# EAGLE design M720 (EAGLE 6.6.0)
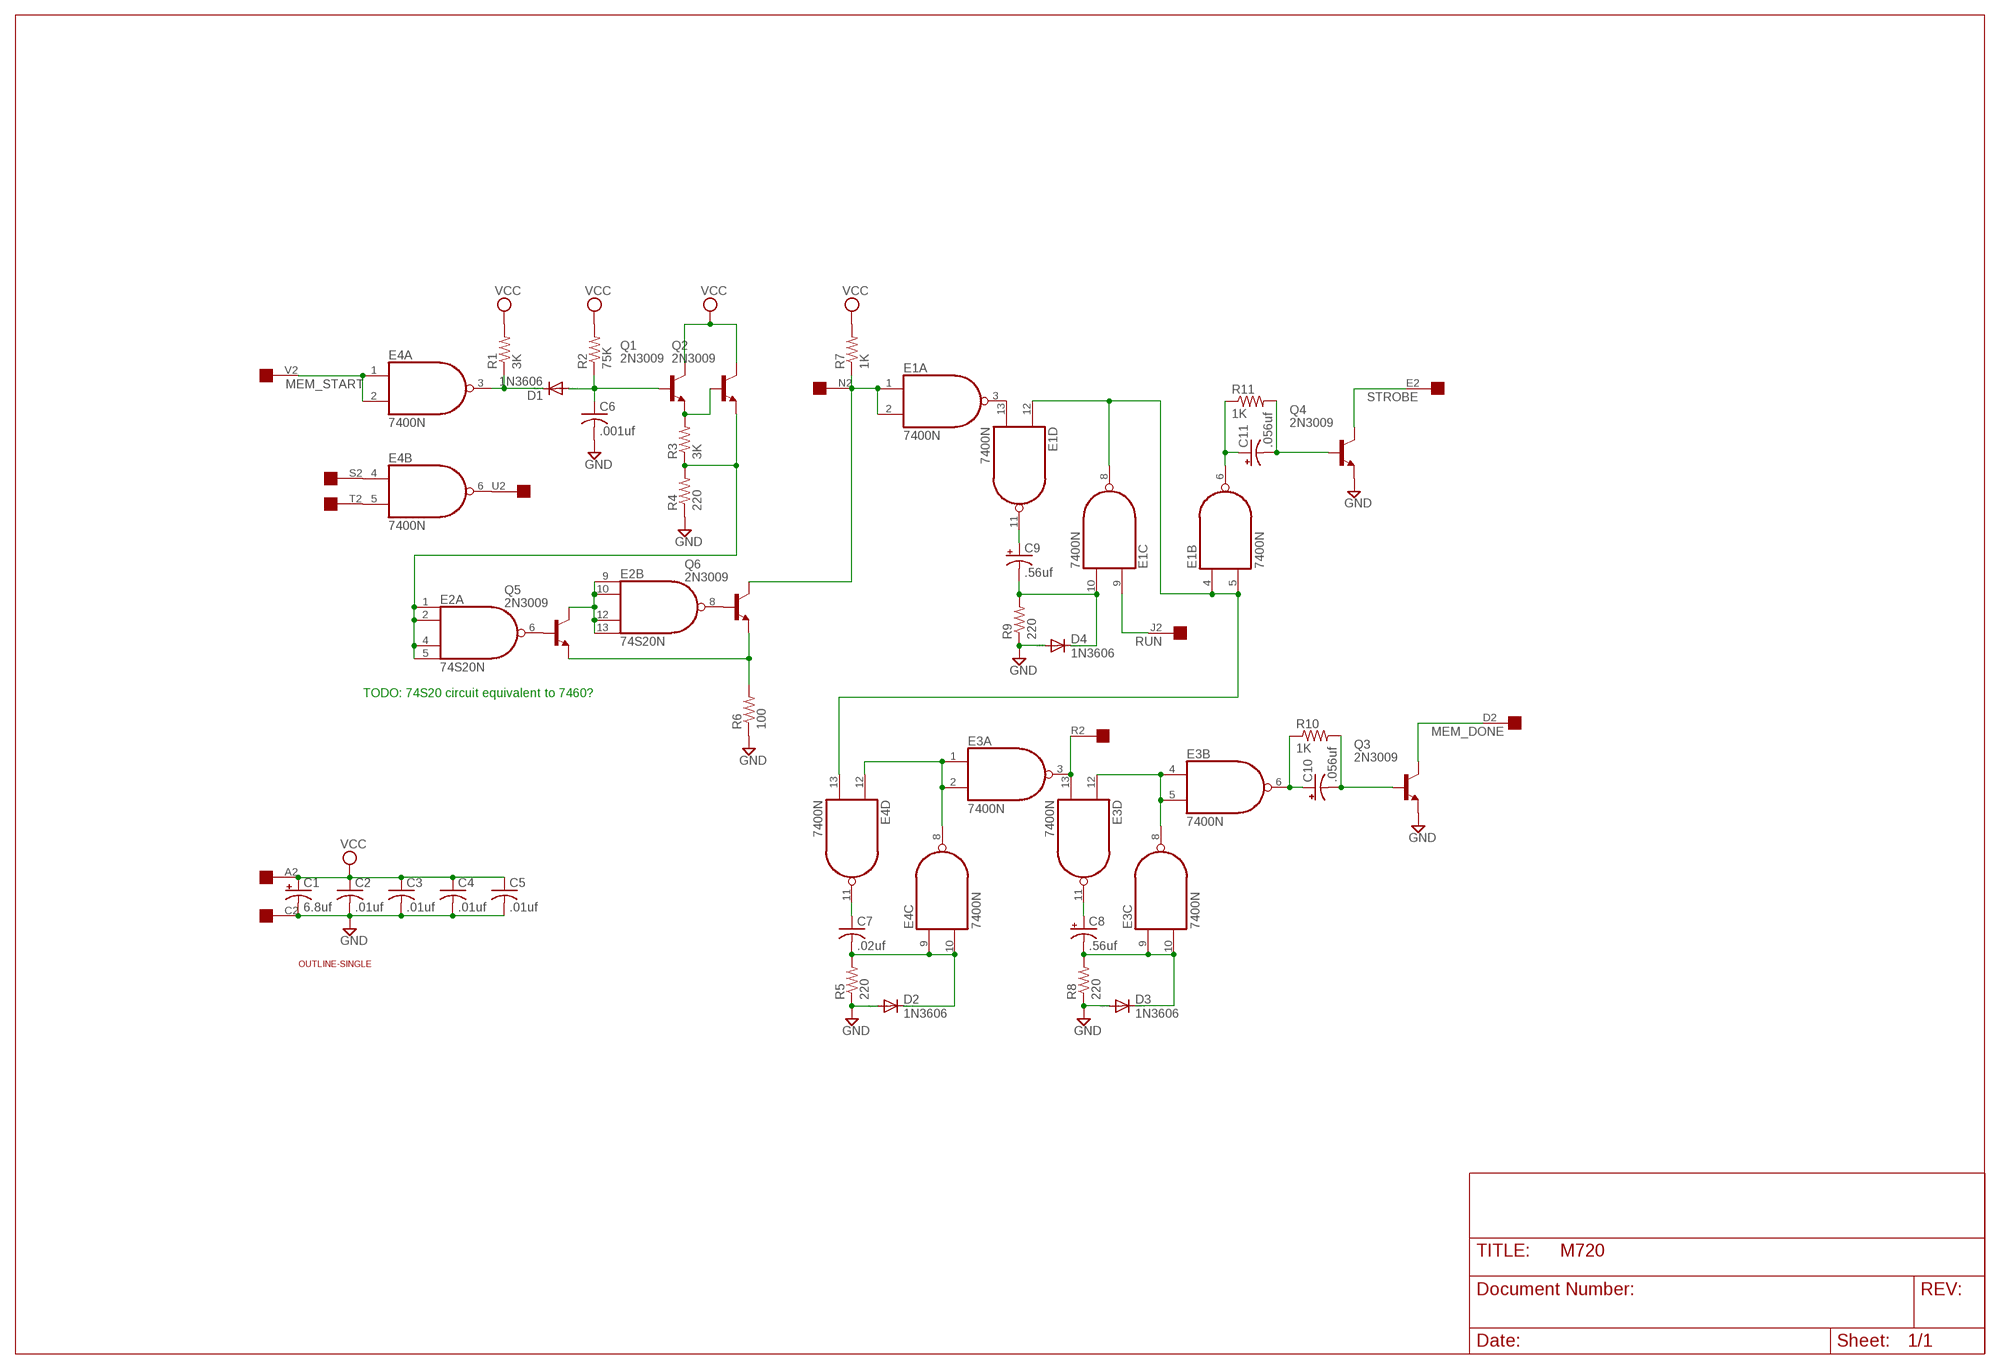
[diagram p0: schematic, sheet 1]

## Parts
C1  6.8uf  CPOL-USE15-5AXIAL  [E15-5]
C2  .01uf  C-US050-025X075  [C050-025X075]
C3  .01uf  C-US050-025X075  [C050-025X075]
C4  .01uf  C-US050-025X075  [C050-025X075]
C5  .01uf  C-US050-025X075  [C050-025X075]
C6  .001uf  C-US050-025X075  [C050-025X075]
C7  .02uf  C-US050-025X075  [C050-025X075]
C8  .56uf  CPOL-USB45181C  [B45181C]
C9  .56uf  CPOL-USB45181C  [B45181C]
C10  .056uf  CPOL-USB45181C  [B45181C]
C11  .056uf  CPOL-USB45181C  [B45181C]
D1  1N3606  1N4148DO35-10  [DO35-10]
D2  1N3606  1N4148DO35-10  [DO35-10]
D3  1N3606  1N4148DO35-10  [DO35-10]
D4  1N3606  1N4148DO35-10  [DO35-10]
E1  7400N  [DIL14]
E2  74S20N  [DIL14]
E3  7400N  [DIL14]
E4  7400N  [DIL14]
Q1  2N3009  2N2405  [TO5]
Q2  2N3009  2N2405  [TO5]
Q3  2N3009  2N2405  [TO5]
Q4  2N3009  2N2405  [TO5]
Q5  2N3009  2N2405  [TO5]
Q6  2N3009  2N2405  [TO5]
R1  3K  R-US_0207/10  [0207/10]
R2  75K  R-US_0207/10  [0207/10]
R3  3K  R-US_0207/10  [0207/10]
R4  220  R-US_0207/10  [0207/10]
R5  220  R-US_0207/10  [0207/10]
R6  100  R-US_0207/10  [0207/10]
R7  1K  R-US_0207/10  [0207/10]
R8  220  R-US_0207/10  [0207/10]
R9  220  R-US_0207/10  [0207/10]
R10  1K  R-US_0207/10  [0207/10]
R11  1K  R-US_0207/10  [0207/10]
U$1  OUTLINE-SINGLE  [SINGLE]
U$3  EDGE-1  [EDGE-CON1]

## Nets
GND [supply]: C1.- C2.2 C3.2 C4.2 C5.2 C6.2 D2.A D3.A D4.A Q3.1(E) Q4.1(E) R4.1 R5.1 R6.1 R8.1 R9.1 U$3.C2
MEM_DONE: Q3.3(C) U$3.D2
MEM_START: E4.1(A:I0) E4.2(A:I1) U$3.V2
N$1: E2.1(A:I0) E2.2(A:I1) E2.4(A:I2) E2.5(A:I3) Q2.1(E) R3.1 R4.2
N$2: D1.C E4.3(A:O) R1.1
N$3: C6.1 D1.A Q1.2(B) R2.1
N$4: Q1.1(E) Q2.2(B) R3.2
N$5: E4.4(B:I0) U$3.S2
N$6: E4.5(B:I1) U$3.T2
N$7: E4.6(B:O) U$3.U2
N$8: E1.1(A:I0) E1.2(A:I1) Q6.3(C) R7.1 U$3.N2
N$9: E1.3(A:O) E1.13(D:I1)
N$10: E1.4(B:I0) E1.5(B:I1) E1.8(C:O) E1.12(D:I0) E4.13(D:I1)
N$11: C7.2 D2.C E4.9(C:I0) E4.10(C:I1) R5.2
N$12: C9.+ E1.11(D:O)
N$13: C9.- D4.C E1.10(C:I1) R9.2
N$14: C11.+ E1.6(B:O) R11.1
N$15: C11.- Q4.2(B) R11.2
N$16: E3.1(A:I0) E3.2(A:I1) E4.8(C:O) E4.12(D:I0)
N$17: C7.1 E4.11(D:O)
N$18: E3.3(A:O) E3.13(D:I1) U$3.R2
N$19: E3.4(B:I0) E3.5(B:I1) E3.8(C:O) E3.12(D:I0)
N$20: E2.8(B:O) Q6.2(B)
N$21: C8.- D3.C E3.9(C:I0) E3.10(C:I1) R8.2
N$22: C8.+ E3.11(D:O)
N$23: C10.+ E3.6(B:O) R10.1
N$24: C10.- Q3.2(B) R10.2
N$25: E2.6(A:O) Q5.2(B)
N$26: E2.9(B:I0) E2.10(B:I1) E2.12(B:I2) E2.13(B:I3) Q5.3(C)
N$28: Q5.1(E) Q6.1(E) R6.2
RUN: E1.9(C:I0) U$3.J2
STROBE: Q4.3(C) U$3.E2
VCC [supply]: C1.+ C2.1 C3.1 C4.1 C5.1 Q1.3(C) Q2.3(C) R1.2 R2.2 R7.2 U$3.A2
Unconnected: U$3.B2 U$3.F2 U$3.H2 U$3.K2 U$3.L2 U$3.M2 U$3.P2

## Notes on the sheet
- TODO: 74S20 circuit equivalent to 7460?

## Power pins joined to a net without a drawn wire
GND: E1.7(P:GND) E2.7(P:GND) E3.7(P:GND) E4.7(P:GND)
VCC: E1.14(P:VCC) E2.14(P:VCC) E3.14(P:VCC) E4.14(P:VCC)

## Library data of the parts
C1 C8-C11 = rcl:CPOL-US: POLARIZED CAPACITOR, American symbol
C2-C7 = rcl:C-US: CAPACITOR, American symbol
D1-D4 = diode:1N4148: DIODE high speed (Philips)
E1 E3 E4 = 74xx-us:74*00: Quad 2-input NAND gate
E2 = 74xx-us:74*20: Dual 4-input NAND gate
Q1-Q6 = transistor:2N2405: NPN TRANSISTOR
R1-R11 = rcl:R-US_: RESISTOR, American symbol
U$1 = dec-con:OUTLINE-*: Board outlines for DEC boards.
U$3 = dec-con:EDGE-1: Single-Sided DEC Edge Connector -- (side 2)

## Net classes
1 supply: width 0.813 mm, clearance 0.508 mm

## Board
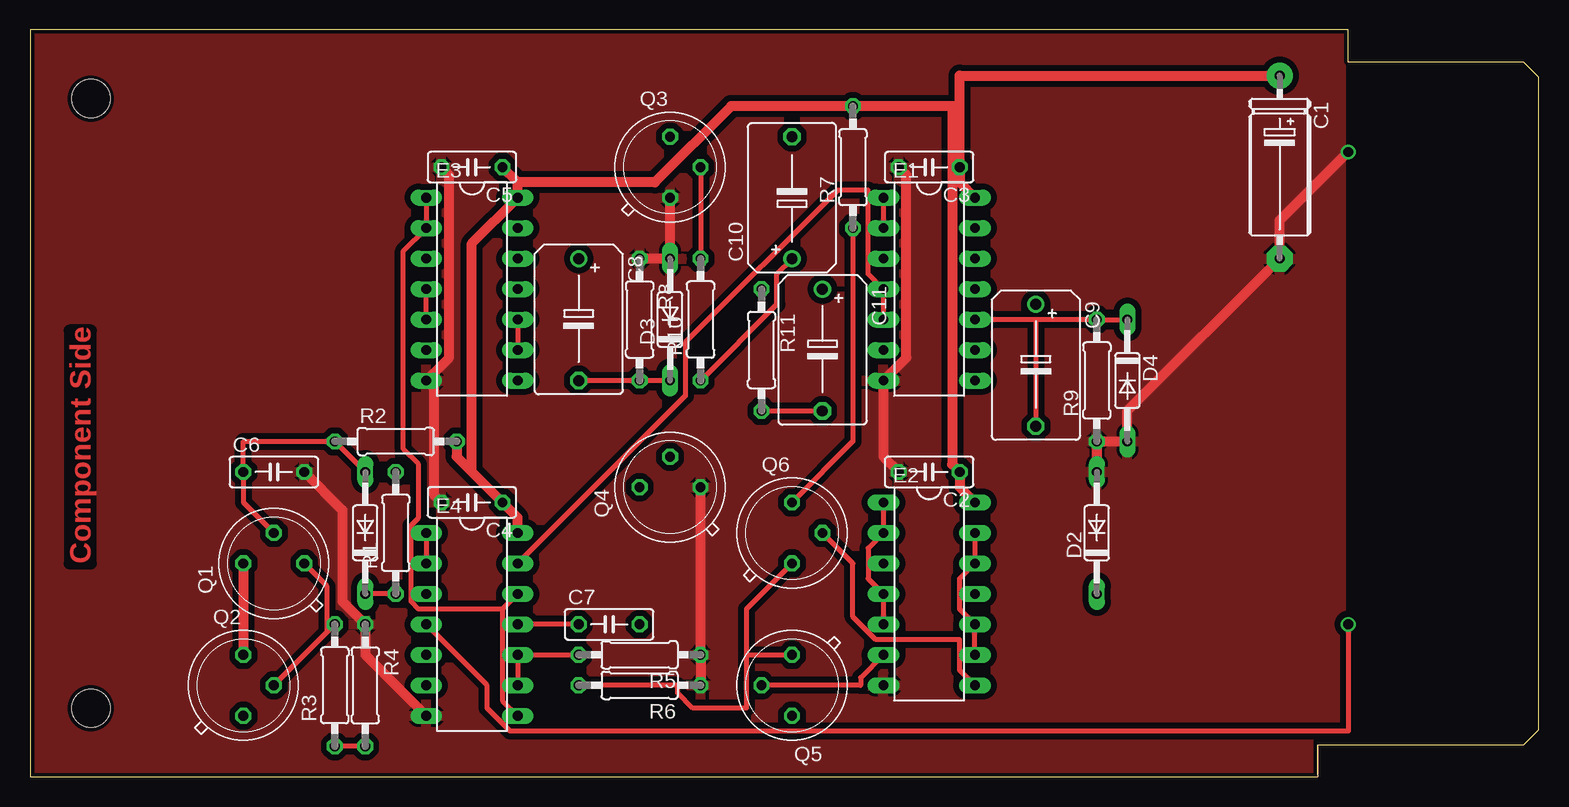
[diagram p1: board, top side]
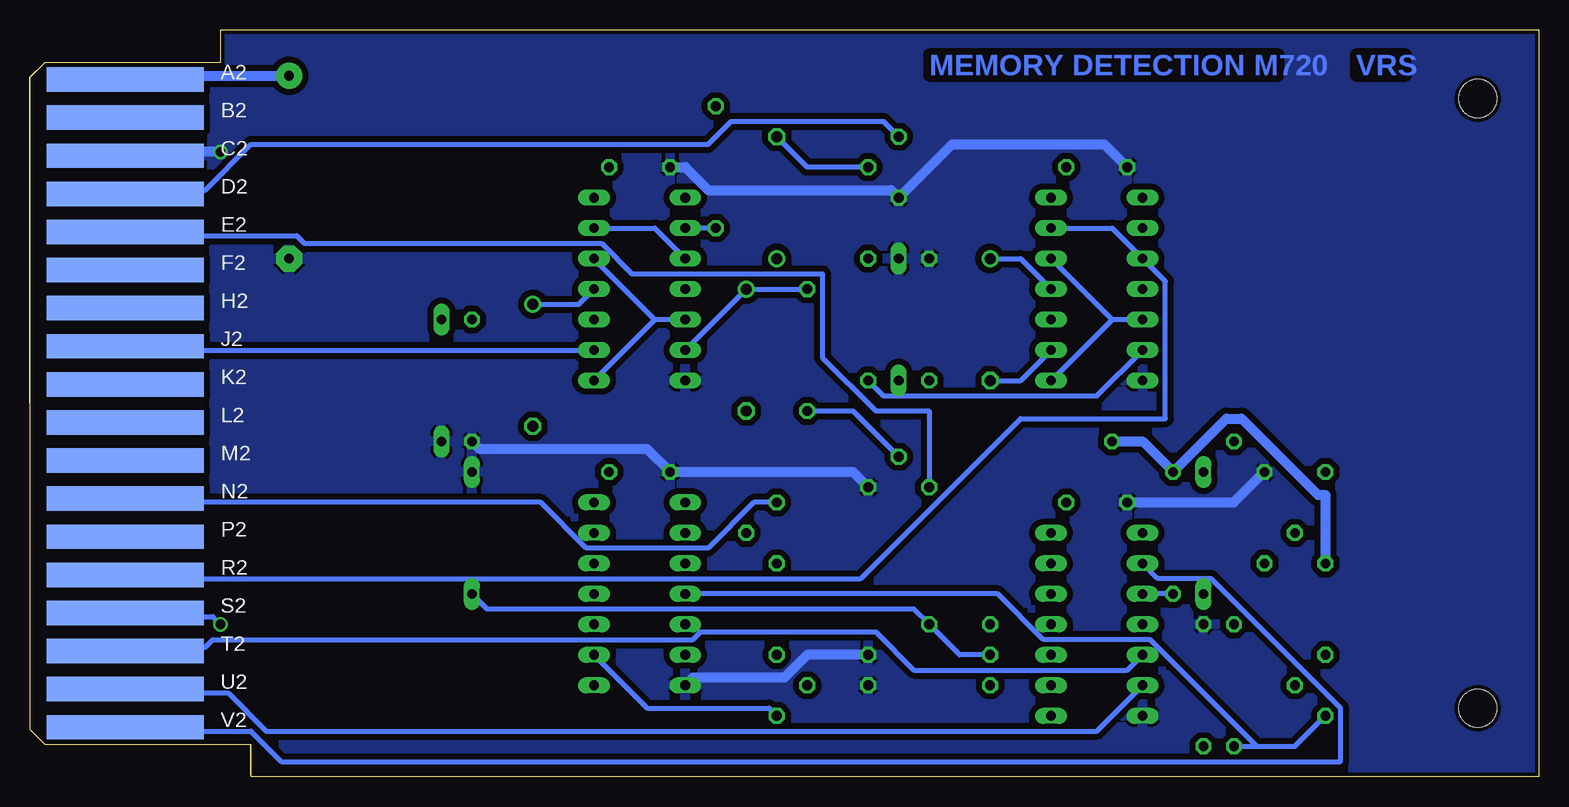
[diagram p2: board, bottom side, seen from below]

Size 125.73 x 62.23 mm. Coordinates in mm from the lower left corner, seen from the top.
Copper layers (1+16): Top 0.035mm / dielectric 1.5mm / Bottom 0.035mm
Design rules "16mils": minimum track width 16mil, minimum drill 32mil, track to track 15mil, track to pad 10mil, pad to pad 10mil, via to via 10mil, smd to smd 10mil, copper to edge 13mil, drill to drill 10mil, minimum pad ring 10mil, minimum via ring 8mil, stop-mask expansion 0mil, vias tented up to drill 0mil, thermal gap 10mil

### Footprints (pad centres in the part's own frame; a part is rotated, then mirrored left to right if it is on the bottom)
E15-5 = drill 0.813 pad 2.159: + -7.62,0 | drill 0.813 pad 2.159 octagon: - 7.62,0
C050-025X075 = drill 0.813 octagon: 1 -2.54,0; 2 2.54,0
B45181C = drill 0.914: + -5.08,0 | drill 0.914 octagon: - 5.08,0
DO35-10 = drill 0.813 long: A 5.08,0; C -5.08,0
DIL14 = drill 0.813 long: 1 -7.62,-3.81; 2 -5.08,-3.81; 3 -2.54,-3.81; 4 0,-3.81; 5 2.54,-3.81; 6 5.08,-3.81; 7 7.62,-3.81; 8 7.62,3.81; 9 5.08,3.81; 10 2.54,3.81; 11 0,3.81; 12 -2.54,3.81; 13 -5.08,3.81; 14 -7.62,3.81
TO5 = drill 0.813 octagon: 1 0,-2.54; 2 2.54,0; 3 0,2.54
0207/10 = drill 0.813 octagon: 1 -5.08,0; 2 5.08,0
SINGLE = hole 3.175: 120.65,56.515; 120.65,5.715
EDGE-CON1 = smd 13.106 x 2.032 bottom: A2 7.938,4.128; B2 7.938,7.303; C2 7.938,10.477; D2 7.938,13.652; E2 7.938,16.828; F2 7.938,20.003; H2 7.938,23.177; J2 7.938,26.352; K2 7.938,29.527; L2 7.938,32.703; M2 7.938,35.877; N2 7.938,39.053; P2 7.938,42.227; R2 7.938,45.403; S2 7.938,48.578; T2 7.938,51.752; U2 7.938,54.928; V2 7.938,58.102

### Placement (x,y rotation side)
C1  104.14,50.8 270 top
C2  74.93,25.4 180 top
C3  74.93,50.8 180 top
C4  36.83,22.86 180 top
C5  36.83,50.8 180 top
C6  20.32,25.4 0 top
C7  48.26,12.7 0 top
C8  45.72,38.1 270 top
C9  83.82,34.29 270 top
C10  63.5,48.26 90 top
C11  66.04,35.56 270 top
D1  27.94,20.32 90 top
D2  88.9,20.32 90 top
D3  53.34,38.1 90 top
D4  91.44,33.02 270 top
E1  74.93,40.64 270 top
E2  74.93,15.24 270 top
E3  36.83,40.64 270 top
E4  36.83,12.7 270 top
Q1  20.32,17.78 90 top
Q2  17.78,7.62 0 top
Q3  53.34,50.8 0 top
Q4  53.34,24.13 90 top
Q5  63.5,7.62 180 top
Q6  63.5,20.32 0 top
R1  30.48,20.32 90 top
R2  30.48,27.94 0 top
R3  25.4,7.62 90 top
R4  27.94,7.62 270 top
R5  50.8,10.16 180 top
R6  50.8,7.62 180 top
R7  68.58,50.8 90 top
R8  50.8,38.1 270 top
R9  88.9,33.02 90 top
R10  55.88,38.1 90 top
R11  60.96,35.56 270 top
U$1  125.73,62.23 180 top
U$3  125.73,62.23 180 top

### Tracks (layer width: path | path; a pad name or v marks a point on that pad's centre or on a via)
GND  (via drill 0.81)
  Top 0.813: D2.A R9.1 D4.A 91.44,30.48 C1.- 104.14,46.35 v109.86,52.07 | E4.7 27.94,10.16 R4.1 26.04,14.61 26.04,22.23 C6.2 | C4.2 33.66,23.5 33.66,32.38 E3.7 34.92,34.92 34.92,50.16 C5.2 | R6.1 R5.1 Q4.1 | R8.1 D3.A Q3.1 | C2.2 71.12,26.67 E1.7 73.03,34.92 73.03,50.16 C3.2
  Bottom 0.813: v109.86,52.07 117.47,52.07 U$3.C2 | C6.2 25.4,22.86 C4.2 | E2.7 70.48,8.26 62.87,8.26 60.96,10.16 R5.1 | C3.2 71.12,50.8 69.22,48.9 53.98,48.9 Q3.1 48.9,52.7 36.2,52.7 C5.2 | Q4.1 57.15,25.4 C2.2 74.3,27.3 88.27,27.3 R9.1
  pour Bottom: 0,62.23 111.76,62.23 111.76,0 0,0
  pour Top: 0,62.23 109.22,62.23 109.22,0 0,0
MEM_DONE
  Bottom 0.406: Q3.3 54.61,54.61 67.31,54.61 69.22,52.7 107.31,52.7 111.12,48.9 117.47,48.9 U$3.D2
MEM_START
  Top 0.406: E4.1 E4.2
  Bottom 0.406: E4.2 31.75,16.51 27.3,16.51 16.51,5.71 16.51,1.27 104.78,1.27 107.31,3.81 117.47,3.81 U$3.V2
N$1
  Top 0.406: E2.5 E2.4 69.85,16.51 69.85,19.05 E2.2 E2.1 | R4.2 R3.1
  Bottom 0.406: Q2.1 20.32,2.54 23.5,2.54 | R3.1 23.5,2.54 | E2.4 45.09,15.24 41.27,11.43 32.38,11.43 23.5,2.54
N$2
  Top 0.406: R1.1 D1.C
  Bottom 0.406: R1.1 E4.3
N$3
  Top 0.406: D1.A R2.1 17.78,27.94 C6.1 17.78,22.86 Q1.2
N$4
  Top 0.406: R3.2 24.77,12.06 | 24.77,12.06 Q2.2 | Q1.1 24.77,15.88 24.77,12.06
N$5  (via drill 0.81)
  Top 0.406: E4.4 38.1,7.62 38.1,5.71 40.01,3.81 109.86,3.81 v109.86,12.7
  Bottom 0.406: v109.86,12.7 110.49,13.34 117.47,13.34 U$3.S2
N$6
  Bottom 0.406: E4.5 34.29,8.89 52.07,8.89 55.24,12.06 69.85,12.06 70.48,11.43 110.49,11.43 111.12,10.79 117.47,10.79 U$3.T2
N$7
  Bottom 0.406: E4.6 36.83,3.81 106.05,3.81 109.22,6.99 117.47,6.99 U$3.U2
N$8
  Top 0.406: E1.1 E1.2 | Q6.3 68.58,27.94 R7.1
  Bottom 0.406: R7.1 E1.2 | Q6.3 65.41,22.86 69.22,19.05 79.38,19.05 83.19,22.86 117.47,22.86 U$3.N2
N$9
  Bottom 0.406: E1.3 73.66,45.72 E1.13
N$10
  Top 0.406: E4.13 54.61,31.75 54.61,36.2 67.31,48.9 69.85,48.9 69.85,41.91 E1.4 E1.5
  Bottom 0.406: 73.66,38.1 E1.8 | E1.5 73.66,38.1 | 73.66,38.1 E1.12
N$11
  Top 0.406: E4.9 E4.10 R5.2
  Bottom 0.406: R5.2 48.26,10.16 C7.2 52.07,13.97 87.63,13.97 D2.C
N$12
  Bottom 0.406: E1.11 80.01,39.37 C9.+
N$13
  Top 0.406: 83.82,38.1 R9.2 D4.C | 83.82,38.1 E1.10 | 83.82,38.1 C9.-
N$14
  Bottom 0.406: E1.6 C11.+ R11.1
N$15
  Top 0.406: R11.2 C11.-
  Bottom 0.406: Q4.2 57.15,30.48 R11.2
N$16
  Top 0.406: E3.1 E3.2 31.11,43.81 31.11,27.3 32.38,26.04 32.38,21.59 31.75,20.95 31.75,14.61 32.38,13.97 39.37,13.97 | E4.8 39.37,6.35 39.37,13.97 | E4.12 39.37,13.97
N$17
  Top 0.406: C7.1 E4.11
N$18
  Bottom 0.406: E3.13 35.56,45.72 E3.3 31.11,41.27 31.11,29.84 43.18,29.84 56.52,16.51 117.47,16.51 U$3.R2
N$19
  Top 0.406: E3.5 E3.4
  Bottom 0.406: 35.56,38.1 E3.8 | E3.5 35.56,38.1 | 35.56,38.1 E3.12
N$20
  Top 0.406: Q6.2 68.58,17.78 68.58,13.34 70.48,11.43 77.47,11.43 77.47,8.89 E2.8
N$21
  Top 0.406: E3.10 E3.9 | D3.C R8.2 C8.-
  Bottom 0.406: E3.9 43.18,33.02 C8.-
N$22
  Bottom 0.406: E3.11 43.18,43.18 C8.+
N$23
  Top 0.406: C10.+ 62.23,41.91 62.23,39.37 R10.1
  Bottom 0.406: E3.6 36.83,31.75 54.61,31.75 R10.1
N$24
  Top 0.406: Q3.2 R10.2
  Bottom 0.406: C10.- 60.96,50.8 Q3.2
N$25
  Top 0.406: Q5.2 69.22,7.62 69.22,8.26 E2.6
N$26
  Top 0.406: E2.13 E2.12 77.47,16.51 77.47,13.97 E2.10 E2.9
  Bottom 0.406: Q5.3 64.14,5.71 74.3,5.71 E2.9
N$28
  Top 0.406: R6.2 53.98,7.62 53.98,6.99 55.24,5.71 59.69,5.71 59.69,10.16 | 59.69,10.16 59.69,13.97 Q6.1 | 59.69,10.16 Q5.1
RUN
  Bottom 0.406: E1.9 117.47,35.56 U$3.J2
STROBE
  Bottom 0.406: Q4.3 50.8,30.48 55.24,30.48 59.69,34.92 59.69,41.91 75.56,41.91 78.11,44.45 102.87,44.45 103.5,45.09 117.47,45.09 U$3.E2
VCC
  Top 0.813: Q1.3 Q2.3 | 40.64,49.53 C5.1 | 40.64,49.53 E3.14 36.83,44.45 36.83,25.4 | E4.14 40.64,21.59 C4.1 36.83,25.4 | 36.83,25.4 35.56,26.67 R2.2 | E2.14 77.47,24.13 C2.1 76.83,26.04 76.83,55.88 | 77.47,55.88 76.83,55.88 | 76.83,55.88 R7.2 58.42,55.88 52.07,49.53 40.64,49.53 | 77.47,55.88 C3.1 77.47,49.53 E1.14 | C1.+ 77.47,58.42 77.47,55.88
  Bottom 0.813: R2.2 33.02,27.94 R1.2 26.04,29.84 24.77,29.84 18.41,23.5 17.78,23.5 Q1.3 | C1.+ 117.47,58.42 U$3.A2

### Text on the board
Top: Component Side
Bottom: VRS | MEMORY DETECTION M720